# EAGLE design ctrl_encoder (EAGLE 6.6.0)
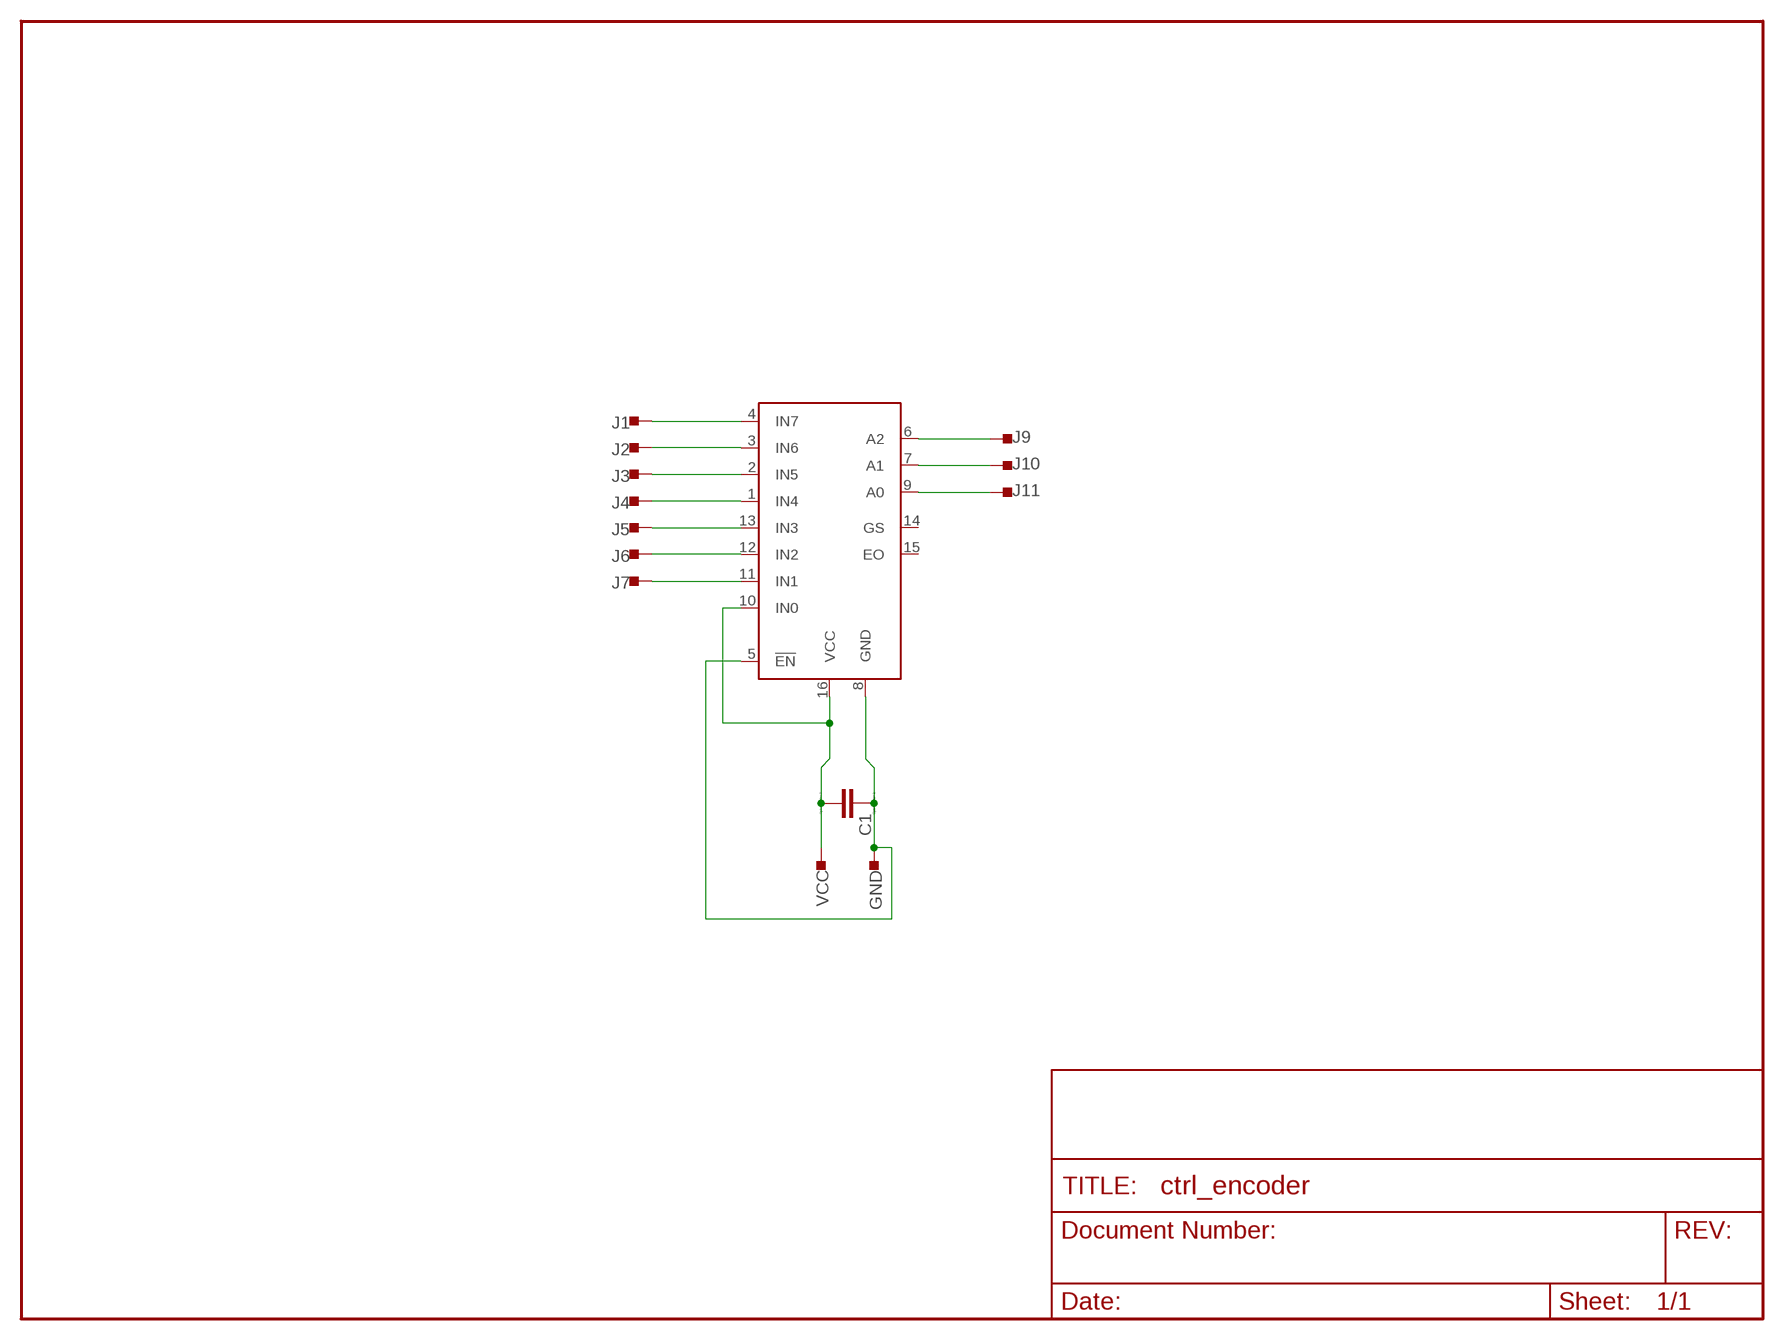
[diagram p0: schematic, sheet 1]

## Parts
C1  C  [C0805]
GND  PAD+SQUARE-1.5X1.5  [PAD-1.5X1.5]
J1  PAD+SQUARE-1.5X1.5  [PAD-1.5X1.5]
J2  PAD+SQUARE-1.5X1.5  [PAD-1.5X1.5]
J3  PAD+SQUARE-1.5X1.5  [PAD-1.5X1.5]
J4  PAD+SQUARE-1.5X1.5  [PAD-1.5X1.5]
J5  PAD+SQUARE-1.5X1.5  [PAD-1.5X1.5]
J6  PAD+SQUARE-1.5X1.5  [PAD-1.5X1.5]
J7  PAD+SQUARE-1.5X1.5  [PAD-1.5X1.5]
J9  PAD+SQUARE-1.5X1.5  [PAD-1.5X1.5]
J10  PAD+SQUARE-1.5X1.5  [PAD-1.5X1.5]
J11  PAD+SQUARE-1.5X1.5  [PAD-1.5X1.5]
U$1  SN74HC148DR  [SO16]
VCC  PAD+SQUARE-1.5X1.5  [PAD-1.5X1.5]

## Nets
GND: C1.1 GND.PAD U$1.5(!EN) U$1.8(GND)
N$1: C1.2 U$1.10(IN0) U$1.16(VCC) VCC.PAD
N$2: J9.PAD U$1.6(A2)
N$3: J1.PAD U$1.4(IN7)
N$4: J2.PAD U$1.3(IN6)
N$5: J3.PAD U$1.2(IN5)
N$6: J4.PAD U$1.1(IN4)
N$7: J5.PAD U$1.13(IN3)
N$8: J6.PAD U$1.12(IN2)
N$9: J7.PAD U$1.11(IN1)
N$11: J10.PAD U$1.7(A1)
N$12: J11.PAD U$1.9(A0)
Unconnected: U$1.14(GS) U$1.15(EO)

## Library data of the parts
C1 = LockBox:C: CAPACITOR, European symbol; SPICEMODEL: NONE; SPICEPREFIX: C
GND J1-J7 J9-J11 VCC = LockBox:PAD+SQUARE: Pad connection
U$1 = LockBox:SN74HC148: 8-Line to 3-Line Priority Encoder Features priority decoding of the inputs to ensure that only the highest-order dataline is encoded Source: http://www.ti.com/lit/ds/symlink/sn74hc148.pdf

## Board
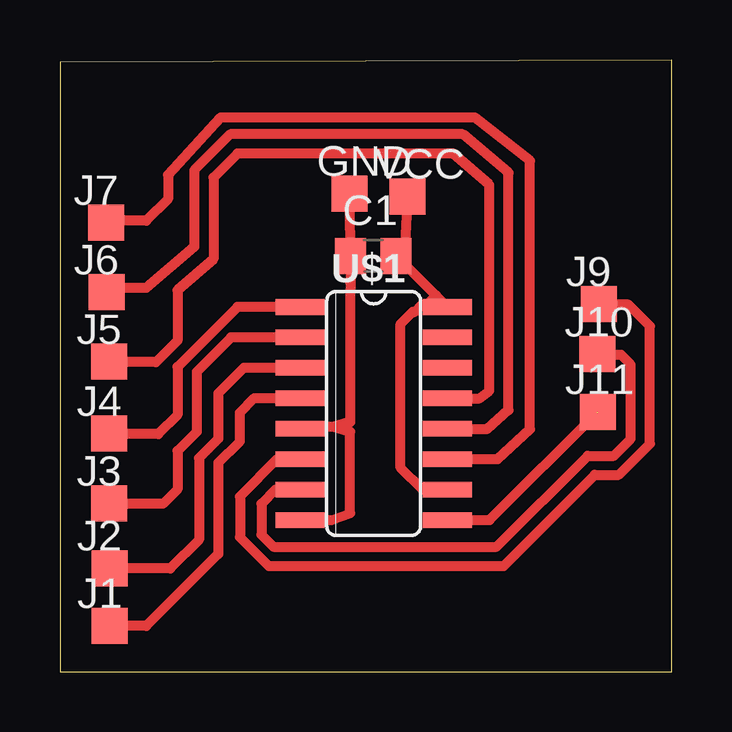
[diagram p1: board, top side]

Size 25.52 x 25.5 mm. Coordinates in mm from the lower left corner, seen from the top.
Outline: 0,0 25.5,0 25.52,25.5 0,25.4 0,0
Copper layers (1*16): Top 0.0178mm / dielectric 59mil / Bottom 0.0178mm
Design rules "epl-lpkf": minimum track width 8mil, minimum drill 0.35mm, track to track 8mil, track to pad 8mil, pad to pad 8mil, via to via 8mil, smd to smd 8mil, copper to edge 15mil, drill to drill 15mil, minimum pad ring 8mil, minimum via ring 8mil, stop-mask expansion 3mil, vias tented up to drill 0mil, thermal gap 10mil

### Footprints (pad centres in the part's own frame; a part is rotated, then mirrored left to right if it is on the bottom)
C0805 = smd 1.3 x 1.5: 1 -0.95,0; 2 0.95,0
PAD-1.5X1.5 = smd 1.5 x 1.5: PAD 0,0
SO16 = smd 0.66 x 2.032: 1 -4.445,-3.073; 2 -3.175,-3.073; 3 -1.905,-3.073; 4 -0.635,-3.073; 5 0.635,-3.073; 6 1.905,-3.073; 7 3.175,-3.073; 8 4.445,-3.073; 9 4.445,3.073; 10 3.175,3.073; 11 1.905,3.073; 12 0.635,3.073; 13 -0.635,3.073; 14 -1.905,3.073; 15 -3.175,3.073; 16 -4.445,3.073

### Placement (x,y rotation side)
C1  13.06,17.33 0 top
GND  12.08,19.93 0 top
J1  2.08,1.91 0 top
J2  2.07,4.31 0 top
J3  2.06,7.01 0 top
J4  2.06,9.92 0 top
J5  2.05,12.92 0 top
J6  1.94,15.82 0 top
J7  1.93,18.72 0 top
J9  22.46,15.33 0 top
J10  22.4,13.23 0 top
J11  22.42,10.83 0 top
U$1  13.08,10.76 270 top
VCC  14.49,19.81 0 top

### Tracks (layer width: path | path; a pad name or v marks a point on that pad's centre or on a via)
GND
  Top 0.406: GND.PAD 12.08,18.76 C1.1 12.11,16.21 12.1,15.7 12.1,10.4 11.4,10.2 | 11.4,10.2 10.08,10.2 U$1.5 | U$1.8 11.31,6.32 12.1,6.6 12.1,10 11.4,10.2
N$1
  Top 0.406: VCC.PAD 14.39,17.81 C1.2 14.03,17.33 15.68,15.68 | 15.68,15.68 U$1.16 | U$1.10 15.12,7.58 14.2,8.5 14.2,14.5 14.7,15 14.8,15 15.1,15.3 15.3,15.3 15.68,15.68
N$2
  Top 0.406: U$1.6 9.05,8.86 7.5,7.3 7.5,5.6 8.7,4.4 18.5,4.4 22.3,8.2 23.3,8.2 24.6,9.5 24.6,14.4 23.7,15.3 22.49,15.3 J9.PAD
N$3
  Top 0.406: U$1.4 9.39,11.39 9.39,11.4 8.1,11.4 7.5,10.8 7.5,9.6 6.6,8.7 6.6,4.9 3.6,1.9 J1.PAD
N$4
  Top 0.406: J2.PAD 4.6,4.3 5.8,5.5 5.8,8.9 6.6,9.7 6.6,11.6 7.67,12.66 U$1.3
N$5
  Top 0.406: J3.PAD 4.3,7 4.9,7.6 4.9,9.2 5.7,10 5.7,12.5 7.13,13.94 U$1.2
N$6
  Top 0.406: J4.PAD 2.08,9.9 4.1,9.9 4.9,10.7 4.9,12.7 7.4,15.2 8,15.2 8.01,15.21 U$1.1
N$7
  Top 0.406: U$1.13 17.5,11.39 17.9,11.7 17.9,20.3 16.4,21.6 7.4,21.6 6.4,20.6 6.4,17.2 4.9,15.9 4.9,13.8 4,12.9 2.07,12.9 J5.PAD
N$8
  Top 0.406: U$1.12 17.82,10.12 18.7,10.9 18.7,20.8 16.8,22.4 7.1,22.4 5.6,20.9 5.6,17.7 3.6,16 2.12,16 J6.PAD
N$9
  Top 0.406: U$1.11 18.25,8.86 19.6,10.1 19.6,21.3 17.3,23.1 6.7,23.1 4.5,20.7 4.5,19.7 3.6,18.8 2.01,18.8 J7.PAD
N$11
  Top 0.406: U$1.7 8.98,7.58 8.4,7 8.4,5.7 8.9,5.2 18.2,5.2 22,9 23.1,9 23.8,9.7 23.8,12.8 23.4,13.2 22.43,13.2 J10.PAD
N$12  (1 unrouted)
  Top 0.406: U$1.9 17.91,6.32 22.4,10.8